# Altium schematic sheet QO100-HF-CON.SchDoc
size A2
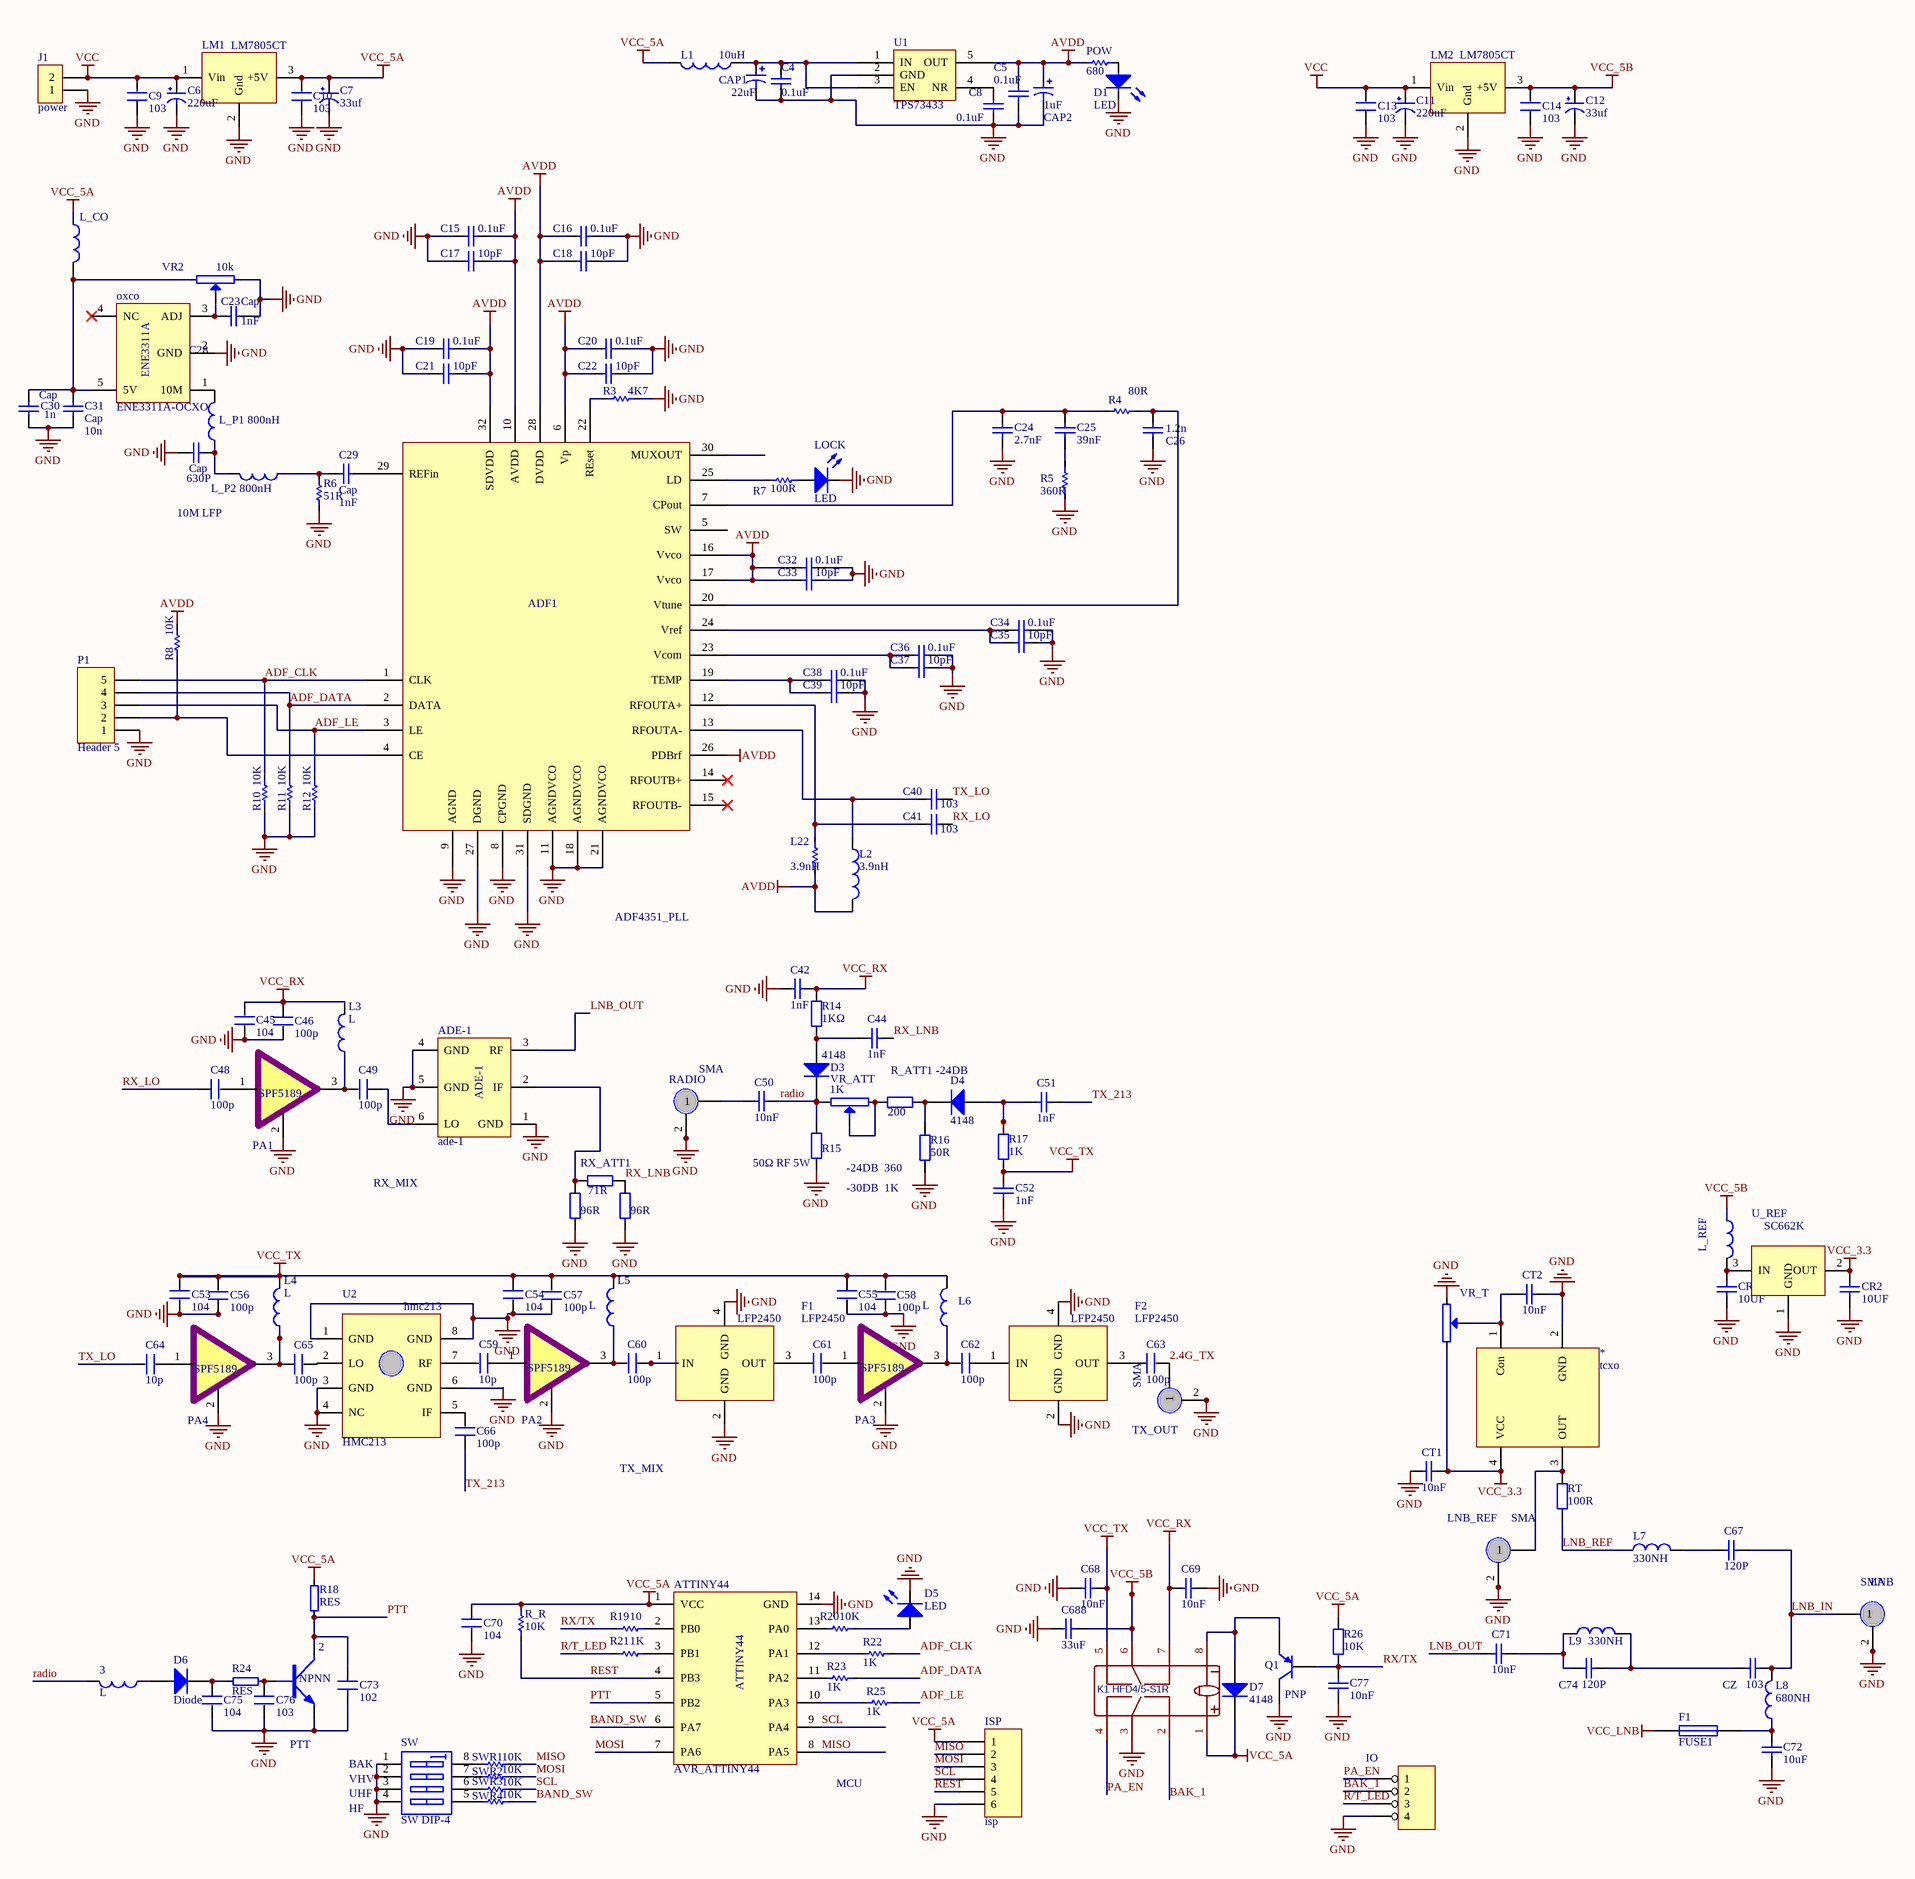
[diagram p0: QO100-HF-CON.SchDoc]

## Parts
(Parts that share a designator on the sheet are numbered #1, #2 ... from top to bottom, then left to right.)
1K  VR_ATT  [res-adj-smd]
2  NPNN  [SOT-23]
3  L  [0805]
10k  VR2  [VR3296]
*  tcxo  [TCXO]
ADE-1  ade-1  [ADE-1]
ADF1  ADF4351  [QFN-32_5x5x05P]  (value not drawn)
ATTINY44  AVR_ATTINY44  [SOP-14_150mil]
C4  value 0.1uF  [0603p]  (hidden comment: Cap)
C5  value 0.1uF  [0603p]  (hidden comment: Cap)
C6  220uF  [CASE-D_7343]
C7  33uf  [1206_C]
C8  value 0.1uF  [0603p]  (hidden comment: Cap)
C9  103  [0805_C]
C10  103  [0805_C]
C11  220uF  [CASE-D_7343]
C12  33uf  [1206_C]
C13  103  [0805_C]
C14  103  [0805_C]
C15  value 0.1uF  [0603P]  (hidden comment: Cap)
C16  value 0.1uF  [0603p]  (hidden comment: Cap)
C17  value 10pF  [0603P]  (hidden comment: Cap)
C18  value 10pF  [0603p]  (hidden comment: Cap)
C19  value 0.1uF  [0603p]  (hidden comment: Cap)
C20  value 0.1uF  [0603p]  (hidden comment: Cap)
C21  value 10pF  [0603p]  (hidden comment: Cap)
C22  value 10pF  [0603p]  (hidden comment: Cap)
C23  Cap  value 1nF  [0603p]
C24  value 2.7nF  [0603p]  (hidden comment: Cap)
C25  value 39nF  [0603p]  (hidden comment: Cap)
C26  value 1.2n  [0603p]  (hidden comment: Cap)
C28  Cap  value 630P  [0603p]
C29  Cap  value 1nF  [0603p]
C30  Cap  value 1n  [0805]
C31  Cap  value 10n  [0805]
C32  value 0.1uF  [0603p]  (hidden comment: Cap)
C33  value 10pF  [0603p]  (hidden comment: Cap)
C34  value 0.1uF  [0603p]  (hidden comment: Cap)
C35  value 10pF  [0603p]  (hidden comment: Cap)
C36  value 0.1uF  [0603p]  (hidden comment: Cap)
C37  value 10pF  [0603p]  (hidden comment: Cap)
C38  value 0.1uF  [0603p]  (hidden comment: Cap)
C39  value 10pF  [0603p]  (hidden comment: Cap)
C40  value 103  [0603p]  (hidden comment: Cap)
C41  value 103  [0603p]  (hidden comment: Cap)
C42  1nF  [0603_C]
C44  1nF  [0603_C]
C45  104  [0603P]
C46  100p  [0603P]
C48  100p  [0603P]
C49  100p  [0603P]
C50  10nF  [0805_C]
C51  1nF  [0603_C]
C52  1nF  [0603_C]
C53  104  [0603P]
C54  104  [0603P]
C55  104  [0603P]
C56  100p  [0603P]
C57  100p  [0603P]
C58  100p  [0603P]
C59  10p  [0603P]
C60  100p  [0805]
C61  100p  [0603P]
C62  100p  [0603P]
C63  100p  [0603P]
C64  10p  [0603P]
C65  100p  [0603P]
C66  100p  [0603P]
C67  120P  [0805_C]
C68  10nF  [0805_C]
C69  10nF  [0805_C]
C70  104  [0603P]
C71  10nF  [0603_C]
C72  10uF  [0805_C]
C73  102  [0603P]
C74  120P  [0805_C]
C75  104  [0603P]
C76  103  [0603P]
C77  10nF  [0603_C]
C688  33uF  [0805_C]
CAP1  value 22uF  [0805]  (hidden comment: Cap Pol1)
CAP2  value 1uF  [0805]  (hidden comment: Cap Pol1)
CR1  10UF  [0603_C]
CR2  10UF  [0603_C]
CT1  10nF  [0603_C]
CT2  10nF  [0603_C]
CZ  103  [0805_C]
D1  LED  [0603P]
D3  4148  [0805_L]
D4  4148  [0805_L]
D5  LED  [0603P]
D6  Diode  [0805]
D7  4148  [0805_L]
F1#1  LFP2450  [LFP2445]
F1#2  FUSE1  [0805]
F2  LFP2450  [LFP2445]
IO  4 HEADER  [HDR1X4]  (value not drawn)
ISP  isp  [HDR1X6]
J1  power  [2PIN]
K1  HFD4/5-S1R  [RELAY-SMD_HFD4/5-S1R]
L1  value 10uH  [0805_L]  (hidden comment: Inductor)
L2  value 3.9nH  [0603p]  (hidden comment: Inductor)
L3  L  [0805]
L4  L  [0805]
L5  L  [0805]
L6  L  [0805]
L7  330NH  [0805]
L8  680NH  [1206_L]
L9  330NH  [0805]
L22  value 3.9nH  [0603p]  (hidden comment: RES)
L_CO  1UH  [0805]  (value not drawn)
L_P1_800nH  330NH  [0603P]  (value not drawn)
L_P2_800nH  330NH  [0603P]  (value not drawn)
L_REF  1UH  [0805]  (value not drawn)
LM1  LM7805CT  [TO-263-3]
LM2  LM7805CT  [TO-263-3]
LNB  SMA  [SMA-w]  (value not drawn)
LNB_REF  SMA  [SMA-w]  (value not drawn)
LOCK  LED  [0603P]
oxco  ENE3311A-OCXO  [ENE3311A]
P1  Header 5  [HDR1X5]
PA1  SPF5189  [SOT-89(SOT-89-3)]  (value not drawn)
PA2  SPF5189  [SOT-89(SOT-89-3)]  (value not drawn)
PA3  SPF5189  [SOT-89(SOT-89-3)]  (value not drawn)
PA4  SPF5189  [SOT-89(SOT-89-3)]  (value not drawn)
POW  value 680  [0603p]  (hidden comment: RES)
Q1  PNP  [SOT-23B_N]
R3  value 4K7  [0603p]  (hidden comment: RES)
R4  value 80R  [0603p]  (hidden comment: RES)
R5  value 360R  [0603p]  (hidden comment: RES)
R6  value 51R  [0603p]  (hidden comment: RES)
R7  value 100R  [0603p]  (hidden comment: RES)
R8  value 10K  [0603p]  (hidden comment: RES)
R10  value 10K  [0603p]  (hidden comment: RES)
R11  value 10K  [0603p]  (hidden comment: RES)
R12  value 10K  [0603p]  (hidden comment: RES)
R14  1KΩ  [0603_R]
R15  50Ω RF 5W  [2225_R]
R16  50R  [1206]
R17  1K  [0603_R]
R18  RES  [0603P]
R19  value 10  [0603p]  (hidden comment: RES)
R20  value 10K  [0603p]  (hidden comment: RES)
R21  value 1K  [0603p]  (hidden comment: RES)
R22  value 1K  [0603p]  (hidden comment: RES)
R23  value 1K  [0603p]  (hidden comment: RES)
R24  RES  [0603P]
R25  value 1K  [0603p]  (hidden comment: RES)
R26  10K  [0603_R]
R_ATT1_-24DB  200  [0805]
R_R  value 10K  [0603p]  (hidden comment: RES)
RADIO  SMA  [SMA-w]  (value not drawn)
RT  100R  [0603_R]
RX_ATT1  71R  [0603_R]
RX_ATT2  96R  [0603_R]
RX_ATT3  96R  [0603_R]
SW  SW DIP-4  [DIP8]
SWR1  value 10K  [0603p]  (hidden comment: RES)
SWR2  value 10K  [0603p]  (hidden comment: RES)
SWR3  value 10K  [0603p]  (hidden comment: RES)
SWR4  value 10K  [0603p]  (hidden comment: RES)
TX_OUT  SMA  [SMA-w]  (value not drawn)
U1  TPS73433  [SOT-23-5]
U2  HMC213  [MSOP-8-PP]
U_REF  SC662K_3.3VLDO  [SOT-23(SOT-23-3)]  (value not drawn)
VR_T  VR_t  [VR3296]  (value not drawn)

## Nets
AVDD: ADF1.6(Vp) ADF1.10(AVDD) ADF1.16(Vvco) ADF1.17(Vvco) ADF1.26(PDBrf) ADF1.28(DVDD) ADF1.32(SDVDD) C5.2 C15.1 C16.2 C17.1 C18.2 C19.1 C20.2 C21.1 C22.2 C32.2 C33.2 CAP2.1 L2.2 L22.1 POW.2 R8.2 U1.5(OUT)
GND: 2.3(E) 10k.1 *.2(GND) ADE-1.1(GND) ADE-1.4(GND) ADE-1.5(GND) ADF1.8(CPGND) ADF1.9(AGND) ADF1.11(AGNDVCO) ADF1.18(AGNDVCO) ADF1.21(AGNDVCO) ADF1.27(DGND) ADF1.31(SDGND) ATTINY44.14(GND) C4.1 C5.1 C6.2(GND) C7.2(GND) C8.1 C9.1 C10.1 C11.2(GND) C12.2(GND) C13.1 C14.1 C15.2 C16.1 C17.2 C18.1 C19.2 C20.1 C21.2 C22.1 C23.2 C24.2 C26.2 C28.1 C30.1 C31.1 C32.1 C33.1 C34.1 C35.1 C36.1 C37.1 C38.1 C39.1 C42.1 C45.1 C46.1 C52.2 C53.1 C54.1 C55.1 C56.1 C57.1 C58.1 C68.1 C69.2 C70.1 C72.2 C73.1 C75.1 C76.1 C77.1 C688.1 CAP1.2 CAP2.2 CR1.2 CR2.2 CT1.2 CT2.1 D1.2(K) D5.2(K) F1#1.2(GND) F1#1.4(GND) F2.2(GND) F2.4(GND) IO.4 ISP.6 J1.1 K1.3 LM1.2(Gnd) LM2.2(Gnd) LNB.2 LNB.3 LNB_REF.2 LNB_REF.3 LOCK.2(K) oxco.2(GND) P1.1 PA1.2 PA2.2 PA3.2 PA4.2 Q1.1(C) R3.2 R5.1 R6.1 R10.1 R11.1 R12.1 R15.1 R16.2 RADIO.2 RADIO.3 RX_ATT2.1 RX_ATT3.1 SW.1(A1) SW.2(A2) SW.3(A3) SW.4(A4) TX_OUT.2 TX_OUT.3 U1.2(GND) U2.1(GND) U2.3(GND) U2.4(NC) U2.6(GND) U2.8(GND) U_REF.1(GND) VR_T.1
VCC: C6.1(VCC) C9.2 C11.1(VCC) C13.2 J1.2 LM1.1(Vin) LM2.1(Vin)
VCC_3.3: *.4(VCC) CR2.1 CT1.1 U_REF.2(OUT) VR_T.2
VCC_5A: ATTINY44.1(VCC) C7.1(VCC) C10.2 C70.2 D7.2(K) ISP.1 K1.1 L1.2 L_CO.2 LM1.3(+5V) R18.2 R26.1 R_R.1
VCC_5B: C12.1(VCC) C14.2 C688.2 K1.6 L_REF.2 LM2.3(+5V)
VCC_LNB: F1#2.1
VCC_RX: C42.2 C45.2 C46.2 C69.1 K1.7 L3.1 R14.2
VCC_TX: C52.1 C53.2 C54.2 C55.2 C56.2 C57.2 C58.2 C68.2 K1.5 L4.1 L5.1 L6.1 R17.2
2.4G_TX: C63.2 TX_OUT.1
ADF_CLK: ADF1.1(CLK) P1.5 R10.2 R22.1
ADF_DATA: ADF1.2(DATA) P1.4 R11.2 R23.1
ADF_LE: ADF1.3(LE) P1.3 R12.2 R25.1
BAK_1: IO.2 K1.2
BAND_SW: ATTINY44.6(PA7) SWR4.1
LNB_IN: C67.1 CZ.1 L8.1 LNB.1
LNB_OUT: ADE-1.3(RF) C71.2
LNB_REF: L7.2 RT.2
MISO: ATTINY44.8(PA5) ISP.2 SWR1.1
MOSI: ATTINY44.7(PA6) ISP.3 SWR2.1
PA_EN: IO.1 K1.4
PTT: 2.2(C) ATTINY44.5(PB2) C73.2 R18.1
R/T_LED: IO.3 R21.2
radio: 1K.2 3.1 C50.2 D3.2(K) R15.2
REST: ATTINY44.4(PB3) ISP.5 R_R.2
RX/TX: C77.2 Q1.2(B) R19.2 R26.2
RX_LNB: C44.2 RX_ATT1.2 RX_ATT3.2
RX_LO: C41.1 C48.1
SCL: ATTINY44.9(PA4) ISP.4 SWR3.1
TX_213: C51.2 C66.1
TX_LO: C40.1 C64.1
Net1K_1: 1K.1 1K.W R_ATT1_-24DB.2
Net2_1: 2.1(B) C76.2 R24.2
Net3_2: 3.2 D6.1(A)
Net10k_2: 10k.2 C30.2 C31.2 L_CO.1 oxco.5(5V)
Net10k_W: 10k.W C23.1 oxco.3(ADJ)
Net*_1: *.1(Con) CT2.2 VR_T.W
Net*_3: *.3(OUT) LNB_REF.1 RT.1
NetADE-1_2: ADE-1.2(IF) RX_ATT1.1 RX_ATT2.2
NetADE-1_6: ADE-1.6(LO) C49.2
NetADF1_4: ADF1.4(CE) P1.2 R8.1
NetADF1_7: ADF1.7(CPout) C24.1 C25.1 R4.2
NetADF1_12: ADF1.12(RFOUTA+) C41.2 L22.2
NetADF1_13: ADF1.13(RFOUTA-) C40.2 L2.1
NetADF1_19: ADF1.19(TEMP) C38.2 C39.2
NetADF1_20: ADF1.20(Vtune) C26.1 R4.1
NetADF1_22: ADF1.22(REset) R3.1
NetADF1_23: ADF1.23(Vcom) C36.2 C37.2
NetADF1_24: ADF1.24(Vref) C34.2 C35.2
NetADF1_25: ADF1.25(LD) R7.1
NetADF1_29: ADF1.29(REFin) C29.2
NetATTINY44_2: ATTINY44.2(PB0) R19.1
NetATTINY44_3: ATTINY44.3(PB1) R21.1
NetATTINY44_10: ATTINY44.10(PA3) R25.2
NetATTINY44_11: ATTINY44.11(PA2) R23.2
NetATTINY44_12: ATTINY44.12(PA1) R22.2
NetATTINY44_13: ATTINY44.13(PA0) R20.2
NetC4_2: C4.2 CAP1.1 L1.1 U1.1(IN) U1.3(EN)
NetC8_2: C8.2 U1.4(NR)
NetC25_2: C25.2 R5.2
NetC28_2: C28.2 L_P1_800nH.2 L_P2_800nH.1
NetC29_1: C29.1 L_P2_800nH.2 R6.2
NetC44_1: C44.1 D3.1(A) R14.1
NetC48_2: C48.2 PA1.1
NetC49_1: C49.1 L3.2 PA1.3
NetC50_1: C50.1 RADIO.1
NetC51_1: C51.1 D4.1(A) R17.1
NetC59_1: C59.1 U2.7(RF)
NetC59_2: C59.2 PA2.1
NetC60_1: C60.1 L5.2 PA2.3
NetC60_2: C60.2 F1#1.1(IN)
NetC61_1: C61.1 F1#1.3(OUT)
NetC61_2: C61.2 PA3.1
NetC62_1: C62.1 L6.2 PA3.3
NetC62_2: C62.2 F2.1(IN)
NetC63_1: C63.1 F2.3(OUT)
NetC64_2: C64.2 PA4.1
NetC65_1: C65.1 L4.2 PA4.3
NetC65_2: C65.2 U2.2(LO)
NetC66_2: C66.2 U2.5(IF)
NetC67_2: C67.2 L7.1
NetC71_1: C71.1 C74.2 L9.2
NetC72_1: C72.1 F1#2.2 L8.2
NetC74_1: C74.1 CZ.2 L9.1
NetC75_2: C75.2 D6.2(K) R24.1
NetCR1_1: CR1.1 L_REF.1 U_REF.3(IN)
NetD1_1: D1.1(A) POW.1
NetD4_2: D4.2(K) R16.1 R_ATT1_-24DB.1
NetD5_1: D5.1(A) R20.1
NetD7_1: D7.1(A) K1.8 Q1.3(E)
NetL_P1_800nH_1: L_P1_800nH.1 oxco.1(10M)
NetLOCK_1: LOCK.1(A) R7.2
NetSW_5: SW.5(B4) SWR4.2
NetSW_6: SW.6(B3) SWR3.2
NetSW_7: SW.7(B2) SWR2.2
NetSW_8: SW.8(B1) SWR1.2

Not connected (* = marked no-connect by the designer): ADF1 5(SW) 14(RFOUTB+)* 15(RFOUTB-)* 30(MUXOUT); oxco 4(NC)*

## Notes on the sheet
- 10M LFP
- ADF4351_PLL
- -24DB  360
- RX_MIX
- -30DB  1K
- TX_MIX
- PTT
- (near SW) BAK
- (near SW) VHV
- (near SW) UHF
- (near ATTINY44) MCU
- (near SW) HF
- (in symbol ENE3311A-OCXO) ENE3311A
- (in symbol HMC213) hmc213
- (in symbol SC662K_3.3VLDO) SC662K

## Library data of the parts
1K = VR: pin to pad: 1>2 2>1 W>3
2 = NPNN: pin to pad: 1>2 2>1
10k VR_T = VR
C4 C5 C8 C15-C26 C28-C41 = Cap: Capacitor; Published: 8-Jun-2000; LatestRevisionDate: 17-Jul-2002; LatestRevisionNote: Re-released for DXP Platform.; PackageReference: RAD-0.3; Publisher: Altium Limited; PackageDescription: Radial Cap, Thru-Hole; 2 Leads; 0.3 in Pin Spacing
C6 C7 C11 C12 = CAP
C9 C10 C13 C14 = C_3
C42 C44 C50-C52 C67-C69 C71 C72 C74 C77 C688 CR1 CR2 CT1 CT2 CZ = 0: 贴片电容; ComponentLink1URL: http://www.szlcsc.com/product/details_52223.html; Package: 0805; Supplier: LC; SuppliersPartNumber: C51210
C45 C46 C48 C49 C53-C66 C70 C73 C75 C76 = C_1
CAP1 CAP2 = Cap Pol1: Polarized Capacitor (Radial); Published: 8-Jun-2000; LatestRevisionDate: 17-Jul-2002; LatestRevisionNote: Re-released for DXP Platform.; PackageReference: RB7.6-15; Publisher: Altium Limited; PackageDescription: Polarized Capacitor (Radial); 2 Leads
D3 D4 D7 = LL-34 LL4148 L: 开关二极管; ComponentLink1URL: http://www.szlcsc.com/product/details_10338.html; Package: LL-34; Supplier: LC; SuppliersPartNumber: C9808
D6 = Diode: Default Diode; Published: 8-Jun-2000; LatestRevisionDate: 17-Jul-2002; LatestRevisionNote: Re-released for DXP Platform.; PackageVersion: Sep-1996; PackageReference: SMC; Publisher: Altium Limited; PackageDescription: DO-214-AB/SMC; 2 C-Bend Leads; Body 7.9 x 5.9 mm, inc. leads (LxW); Code_JEDEC: DO-214-AB
F1#2 = FUSE1: Fuse
IO = 4 HEADER: 4 Pin Header
ISP = Header 6: Header, 6-Pin; LatestRevisionDate: 17-Jul-2002; LatestRevisionNote: Re-released for DXP Platform.; Publisher: Altium Limited
J1 = CON: Connector
K1 = HFD4: BOM_Manufacturer: HF; Contributor: LCSC; BOM_Supplier: LCSC; BOM_Manufacturer Part: HFD4/5-S1R; BOM_Supplier Part: C124871; spicePre: K; spiceSymbolName: HFD4/5-S1R
L1 L2 = Inductor: Code_IEC: 1005; Published: 8-Jun-2000; LatestRevisionDate: 29-May-2009; LatestRevisionNote: IPC-7351 Footprint Added.; PackageReference: 0402-A; Publisher: Altium Limited; PackageDescription: Chip Inductor; Code_JEITA: 0402
L7-L9 L_CO L_P1_800nH L_P2_800nH L_REF = L
P1 = Header 5: Header, 5-Pin; LatestRevisionDate: 17-Jul-2002; LatestRevisionNote: Re-released for DXP Platform.; Publisher: Altium Limited
Q1 = PNP: PNP Bipolar Transistor; pin to pad: 1>2 2>1; Published: 8-Jun-2000; LatestRevisionDate: 29-May-2009; LatestRevisionNote: IPC-7351 Footprint Added.; PackageVersion: Aug-1999; PackageReference: SOT-23B; Publisher: Altium Limited; PackageDescription: 3-Pin SOT-23 Package 0.95 mm Pitch, 2.4 mm Lead Span
R14-R17 R26 R_ATT1_-24DB RT = 0805 1KΩ (1001) 1%: 贴片电阻; ComponentLink1URL: http://www.szlcsc.com/product/details_18201.html; Package: 0805; Supplier: LC; SuppliersPartNumber: C17513
R18 R24 = RE
RX_ATT1-RX_ATT3 = 0603 2.2Ω: 贴片电阻; ComponentLink1URL: http://www.szlcsc.com/product/details_23666.html; Package: 0603; Supplier: LC; SuppliersPartNumber: C22939
SW = SW DIP-4: DIP Switch